# Altium schematic sheet 调理电路.SchDoc
size A4
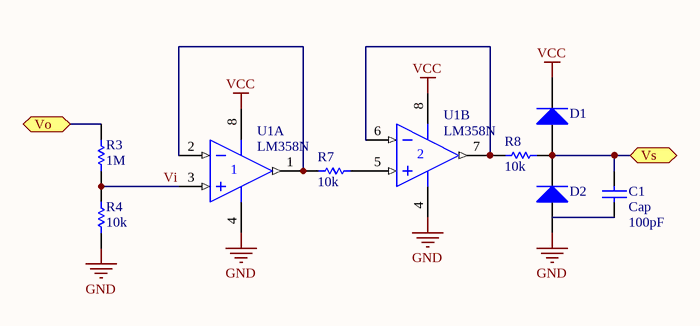
[diagram p0: 调理电路.SchDoc]

## Parts
C1  Cap  value 100pF  [RAD-0.3]
D1  (no value)  [SMC]
D2  (no value)  [SMC]
R3  value 1M  [AXIAL-0.3]
R4  value 10k  [AXIAL-0.3]
R7  value 10k  [AXIAL-0.3]
R8  value 10k  [AXIAL-0.3]
U1  LM358N  [626-05]  (parts A,B of 2)

## Ports
Vo, Vs

## Nets
GND: D2.1(A) R4.1 U1.4(V-)
VCC: D1.2(K) U1.8(V+)
Vi: R3.1 R4.2 U1.3(IN+)
Vo: R3.2 ; port Vo
Vs: C1.2 D1.1(A) D2.2(K) R8.1 ; port Vs
NetR7_1: R7.1 U1.5(IN+)
NetR7_2: R7.2 U1.1(OUT) U1.2(IN-)
NetR8_2: R8.2 U1.6(IN-) U1.7(OUT)

Not connected (* = marked no-connect by the designer): C1 1

## Library data of the parts
C1 = Cap: Capacitor; Published: 8-Jun-2000; LatestRevisionDate: 17-Jul-2002; LatestRevisionNote: Re-released for DXP Platform.; PackageReference: RAD-0.3; Publisher: Altium Limited
D1 D2 = Diode: Default Diode; Published: 8-Jun-2000; LatestRevisionDate: 17-Jul-2002; LatestRevisionNote: Re-released for DXP Platform.; PackageDocument: Sep-1996; PackageReference: SMC; Publisher: Altium Limited; Code_JEDEC: DO-214-AB
R3 R4 R7 R8 = Res1: Resistor; Published: 8-Jun-2000; LatestRevisionDate: 17-Jul-2002; LatestRevisionNote: Re-released for DXP Platform.; PackageReference: AXIAL-0.3; Publisher: Altium Limited
U1 = LM358N: Dual Low-Power Operational Amplifier; Published: 17-Jul-2002; LatestRevisionDate: 06-Jun-2005; LatestRevisionNote: Stylized 3D Model Added.; DatasheetVersion: 1988; PackageReference: 626-05; Publisher: Altium Limited; PackageDescription: DIP; 8 Leads; Row Spacing 7.62 mm; Pitch 2.54 mm; ComponentLink1Description: Manufacturer Link; ComponentLink1URL: http://www.onsemi.com/site/products/parametrics/0,4446,251,00.html; ComponentLink2Description: Datasheet; ComponentLink2URL: http://www.onsemi.com/pub/Collateral/LM358-D.PDF